# Altium schematic sheet ARCHITECTURE.SchDoc: Architecture
size 420 x 297 mm; SheetNumber: 1
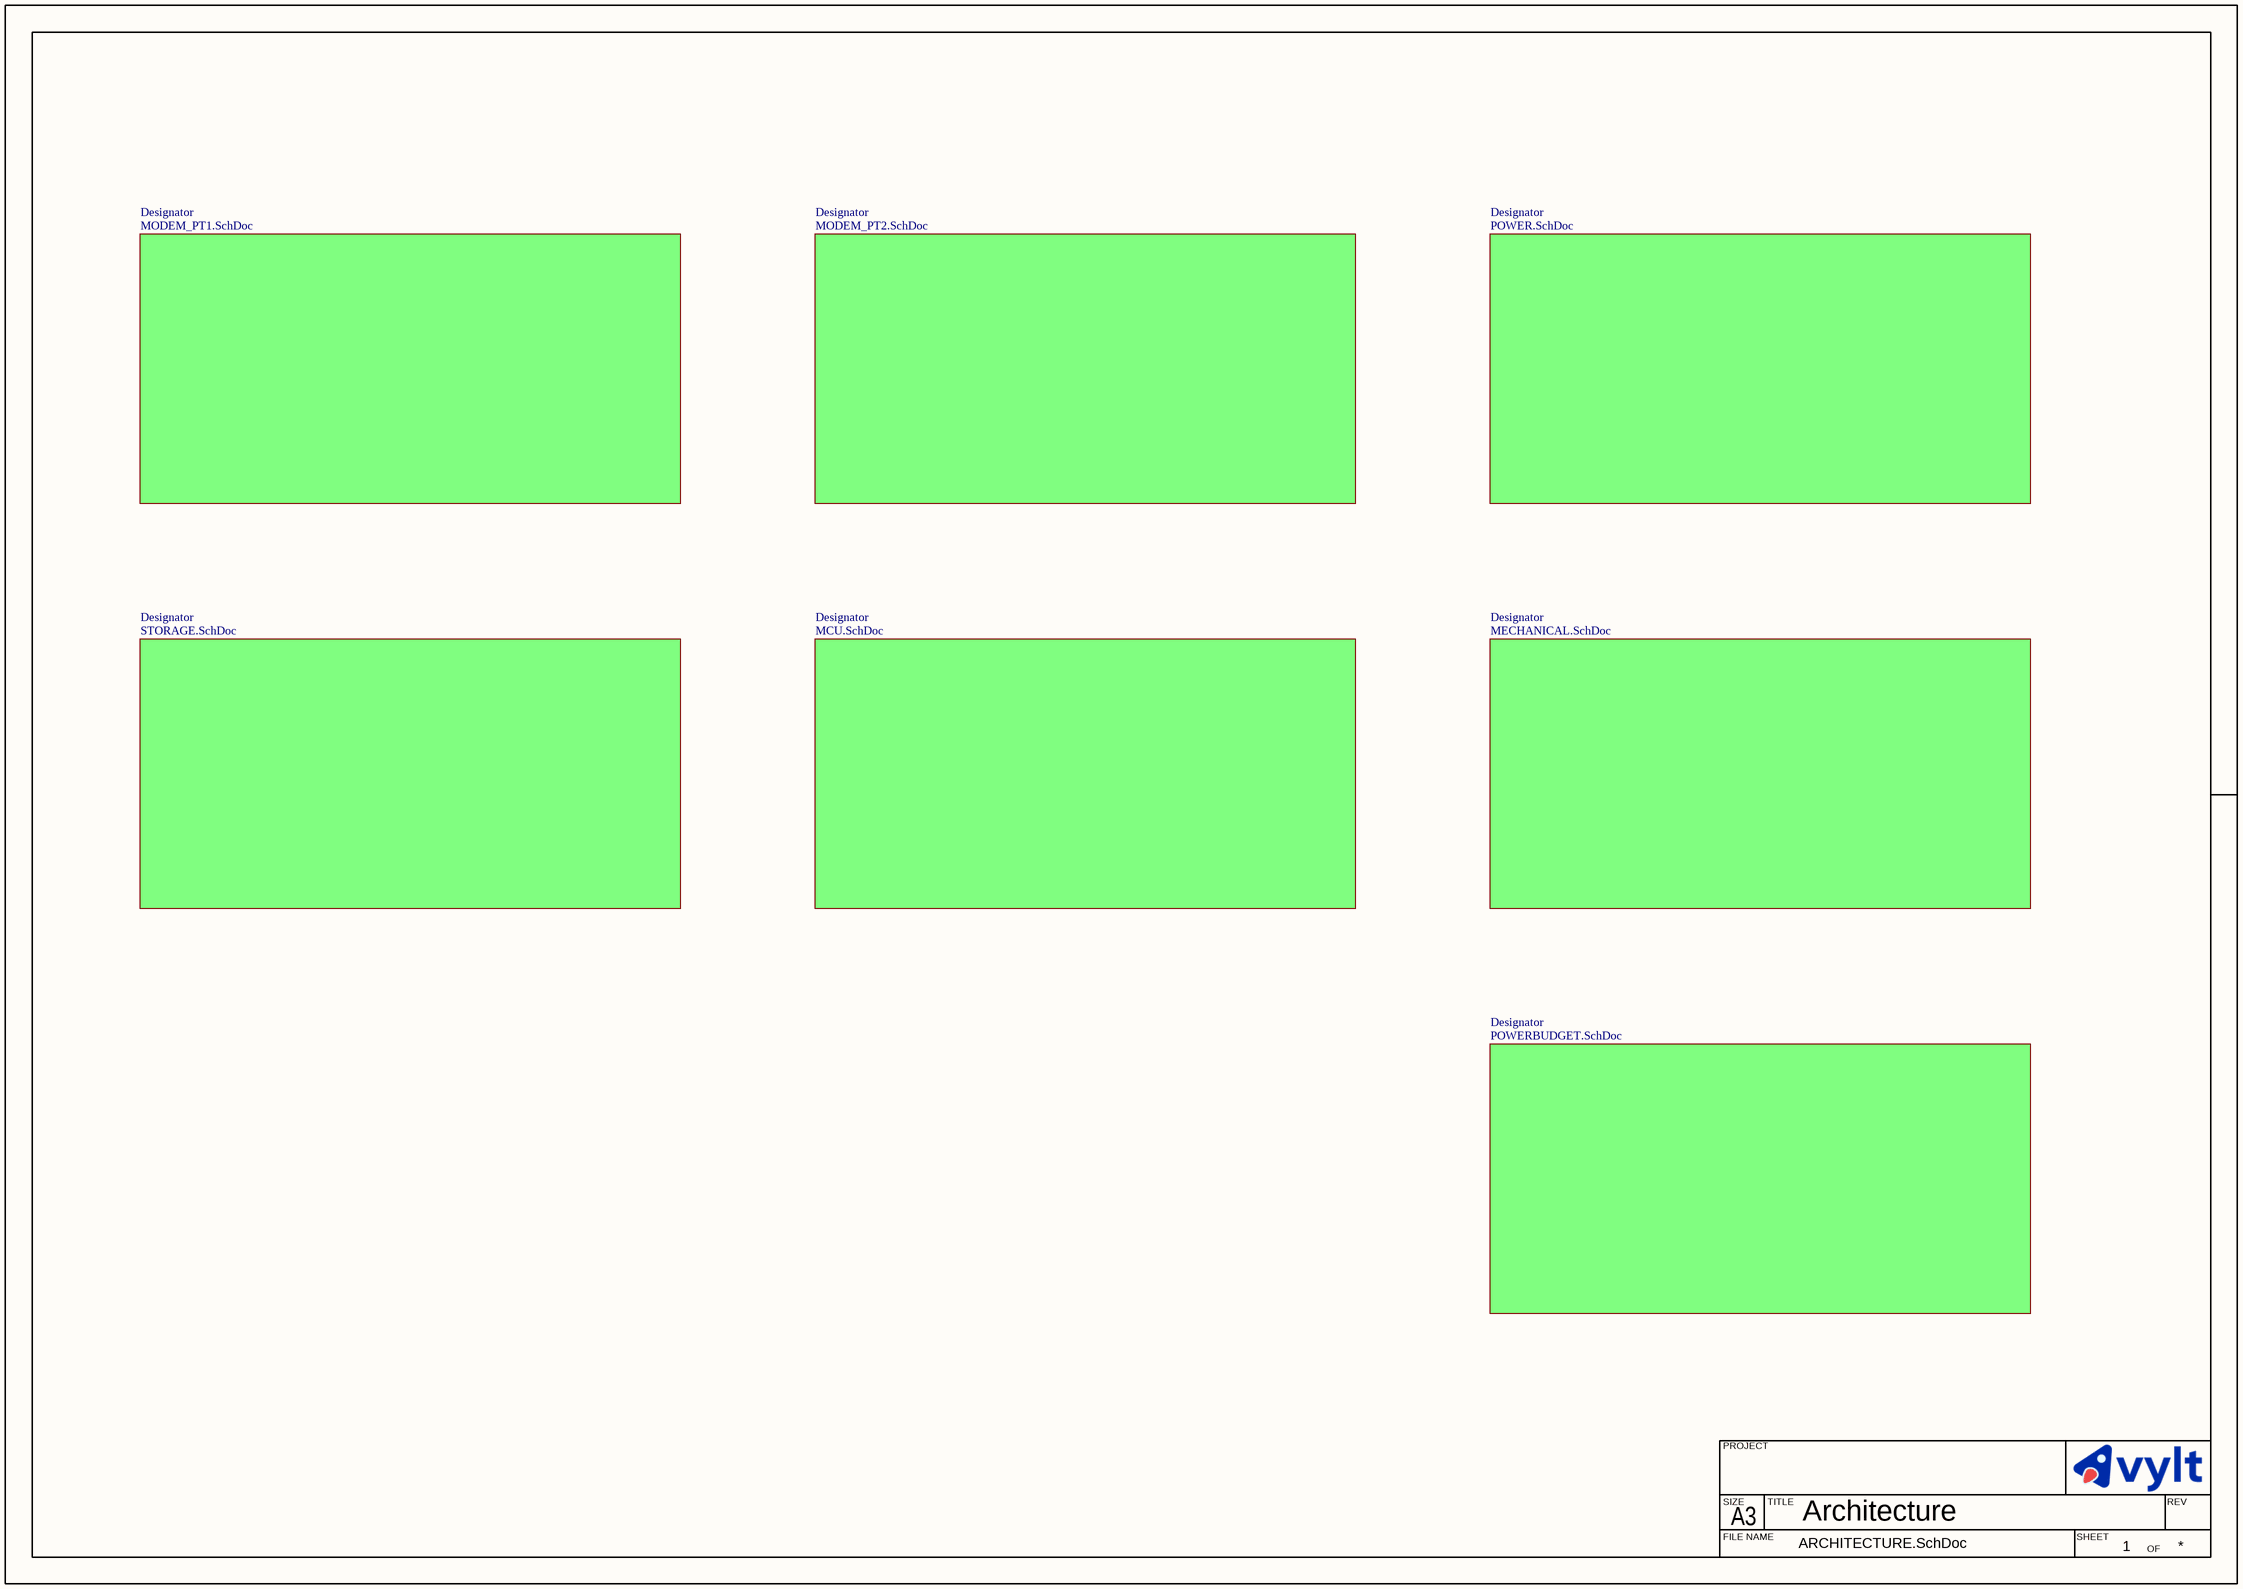
[diagram p0: ARCHITECTURE.SchDoc]

## Sub-sheets
Designator = MCU.SchDoc: no entries
Designator = MODEM_PT2.SchDoc: no entries
Designator = MECHANICAL.SchDoc: no entries
Designator = STORAGE.SchDoc: no entries
Designator = MODEM_PT1.SchDoc: no entries
Designator = POWER.SchDoc: no entries
Designator = POWERBUDGET.SchDoc: no entries

## Notes on the sheet
- PROJECT
- SIZE
- FILE NAME
- A3
- TITLE
- SHEET
- OF
- REV